# EAGLE design StackBreakoutConnection_4layers_V1.0 (EAGLE 9.4.2)
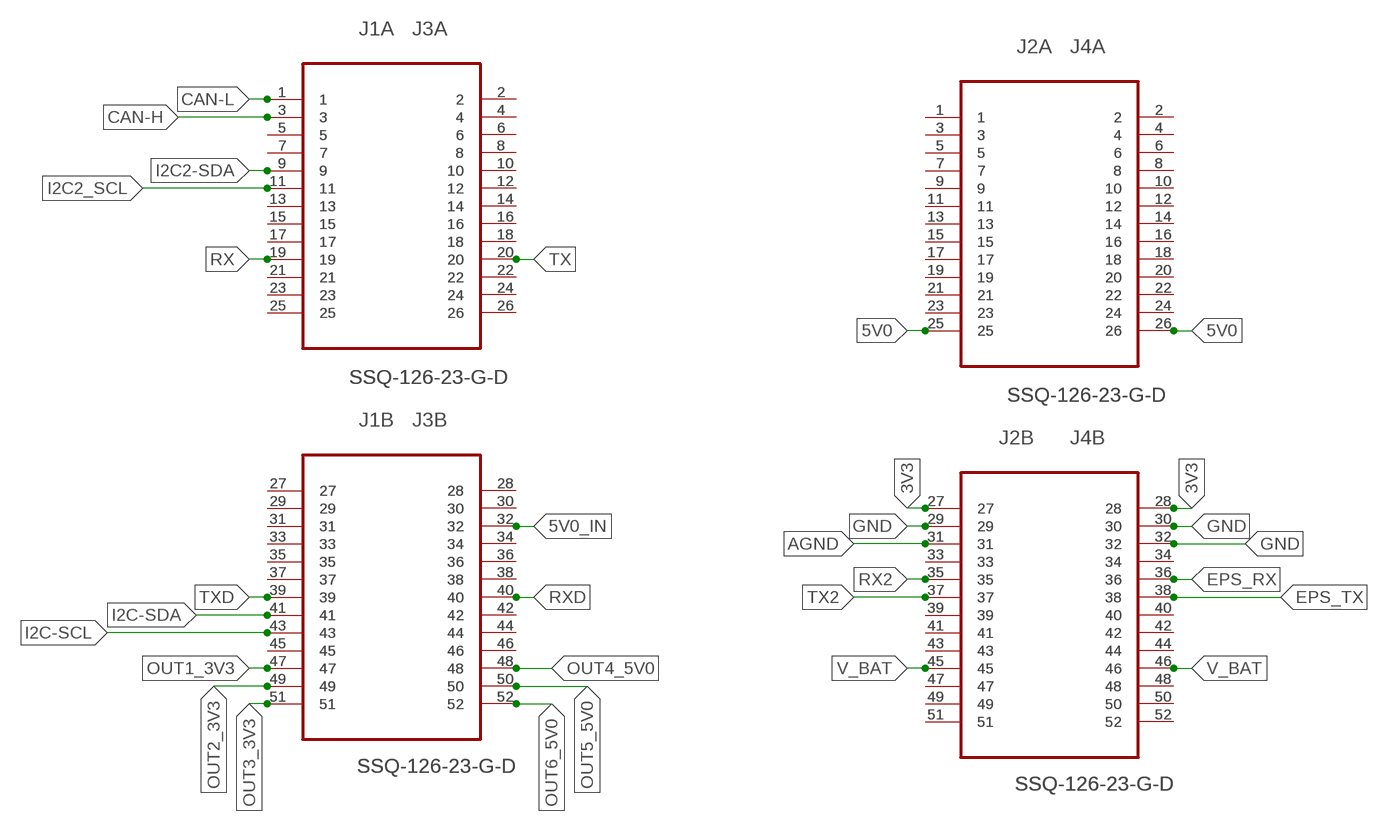
[diagram p0: schematic, sheet 1]

## Parts
J1  SSQ-126-23-G-D  [SAMTEC_SSQ-126-23-G-D]
J2  SSQ-126-23-G-D  [SAMTEC_SSQ-126-23-G-D]
J3  SSQ-126-23-G-D  [SAMTEC_SSQ-126-23-G-D]
J4  SSQ-126-23-G-D  [SAMTEC_SSQ-126-23-G-D]

## Nets
3V3: J2.27 J2.28 J4.27 J4.28
5V0: J2.25 J2.26 J4.25 J4.26
5V0_IN: J1.32 J3.32
AGND: J2.31 J4.31
CAN-H: J1.3 J3.3
CAN-L: J1.1 J3.1
EPS_RX: J2.36 J4.36
EPS_TX: J2.38 J4.38
GND: J2.29 J2.30 J2.32 J4.29 J4.30 J4.32
I2C2-SDA: J1.9 J3.9
I2C2_SCL: J1.11 J3.11
I2C-SCL: J1.43 J3.43
I2C-SDA: J1.41 J3.41
N$3: J1.5 J3.5
N$4: J1.7 J3.7
N$7: J1.13 J3.13
N$8: J1.15 J3.15
N$9: J1.17 J3.17
N$11: J1.21 J3.21
N$12: J1.23 J3.23
N$13: J1.25 J3.25
N$14: J1.2 J3.2
N$15: J1.4 J3.4
N$16: J1.6 J3.6
N$17: J1.8 J3.8
N$18: J1.10 J3.10
N$19: J1.12 J3.12
N$20: J1.14 J3.14
N$21: J1.16 J3.16
N$22: J1.18 J3.18
N$24: J1.22 J3.22
N$25: J1.24 J3.24
N$26: J1.26 J3.26
N$27: J1.27 J3.27
N$28: J1.29 J3.29
N$29: J1.31 J3.31
N$30: J1.33 J3.33
N$31: J1.35 J3.35
N$32: J1.37 J3.37
N$36: J1.45 J3.45
N$40: J1.28 J3.28
N$41: J1.30 J3.30
N$43: J1.34 J3.34
N$44: J1.36 J3.36
N$45: J1.38 J3.38
N$47: J1.42 J3.42
N$48: J1.44 J3.44
N$49: J1.46 J3.46
N$53: J2.1 J4.1
N$54: J2.3 J4.3
N$55: J2.5 J4.5
N$56: J2.7 J4.7
N$57: J2.9 J4.9
N$58: J2.11 J4.11
N$59: J2.13 J4.13
N$60: J2.15 J4.15
N$61: J2.17 J4.17
N$62: J2.19 J4.19
N$63: J2.21 J4.21
N$64: J2.23 J4.23
N$66: J2.2 J4.2
N$67: J2.4 J4.4
N$68: J2.6 J4.6
N$69: J2.8 J4.8
N$70: J2.10 J4.10
N$71: J2.12 J4.12
N$72: J2.14 J4.14
N$73: J2.16 J4.16
N$74: J2.18 J4.18
N$75: J2.20 J4.20
N$76: J2.22 J4.22
N$77: J2.24 J4.24
N$82: J2.33 J4.33
N$85: J2.39 J4.39
N$86: J2.41 J4.41
N$87: J2.43 J4.43
N$89: J2.47 J4.47
N$90: J2.49 J4.49
N$91: J2.51 J4.51
N$95: J2.34 J4.34
N$98: J2.40 J4.40
N$99: J2.42 J4.42
N$100: J2.44 J4.44
N$102: J2.48 J4.48
N$103: J2.50 J4.50
N$104: J2.52 J4.52
OUT1_3V3: J1.47 J3.47
OUT2_3V3: J1.49 J3.49
OUT3_3V3: J1.51 J3.51
OUT4_5V0: J1.48 J3.48
OUT5_5V0: J1.50 J3.50
OUT6_5V0: J1.52 J3.52
RX: J1.19 J3.19
RX2: J2.35 J4.35
RXD: J1.40 J3.40
TX: J1.20 J3.20
TX2: J2.37 J4.37
TXD: J1.39 J3.39
V_BAT: J2.45 J2.46 J4.45 J4.46

## Library data of the parts
J1-J4 = SPEL:SSQ-126-23-G-D: CONN RECEPTACLE, 2.54MM, DUAL, 52WAY; MPN: SSQ-126-23-G-D; OC_FARNELL: -; OC_NEWARK: 82P0504; PACKAGE: RECEPTACLE, 2.54MM, DUAL, 52WAY; SUPPLIER: Samtec

## Board
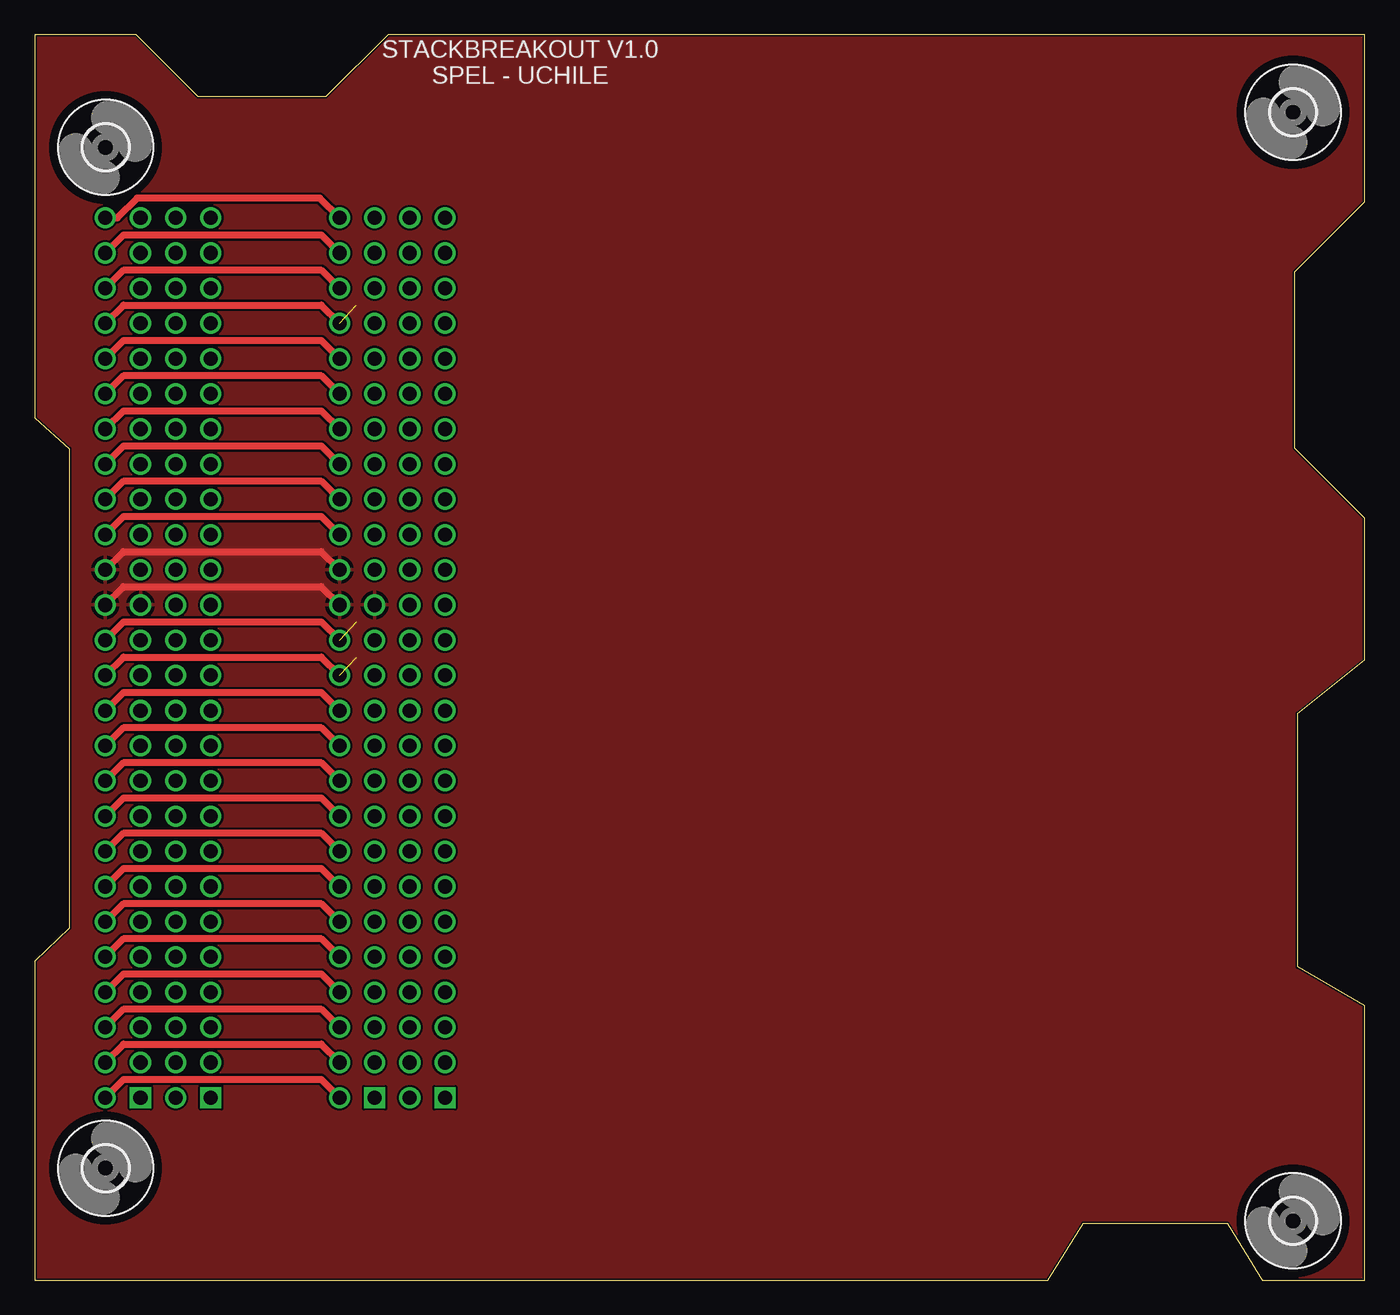
[diagram p1: board, top side]
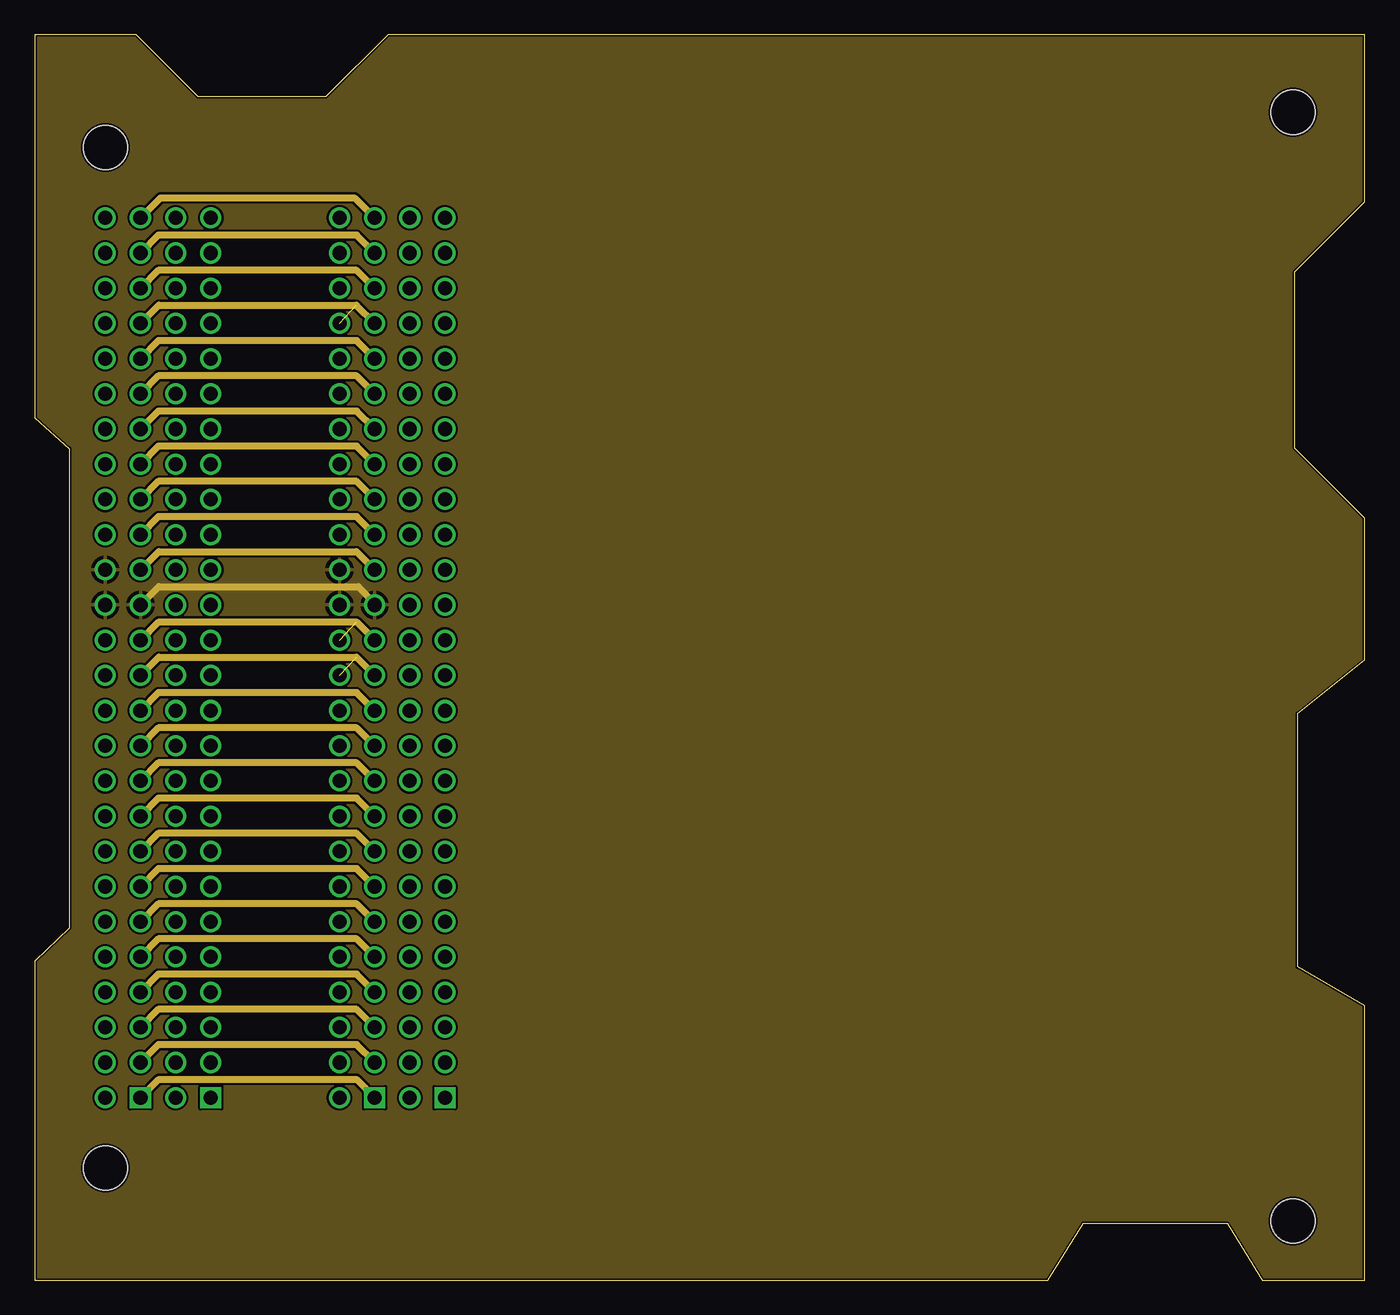
[diagram p2: board, inner layer Route2]
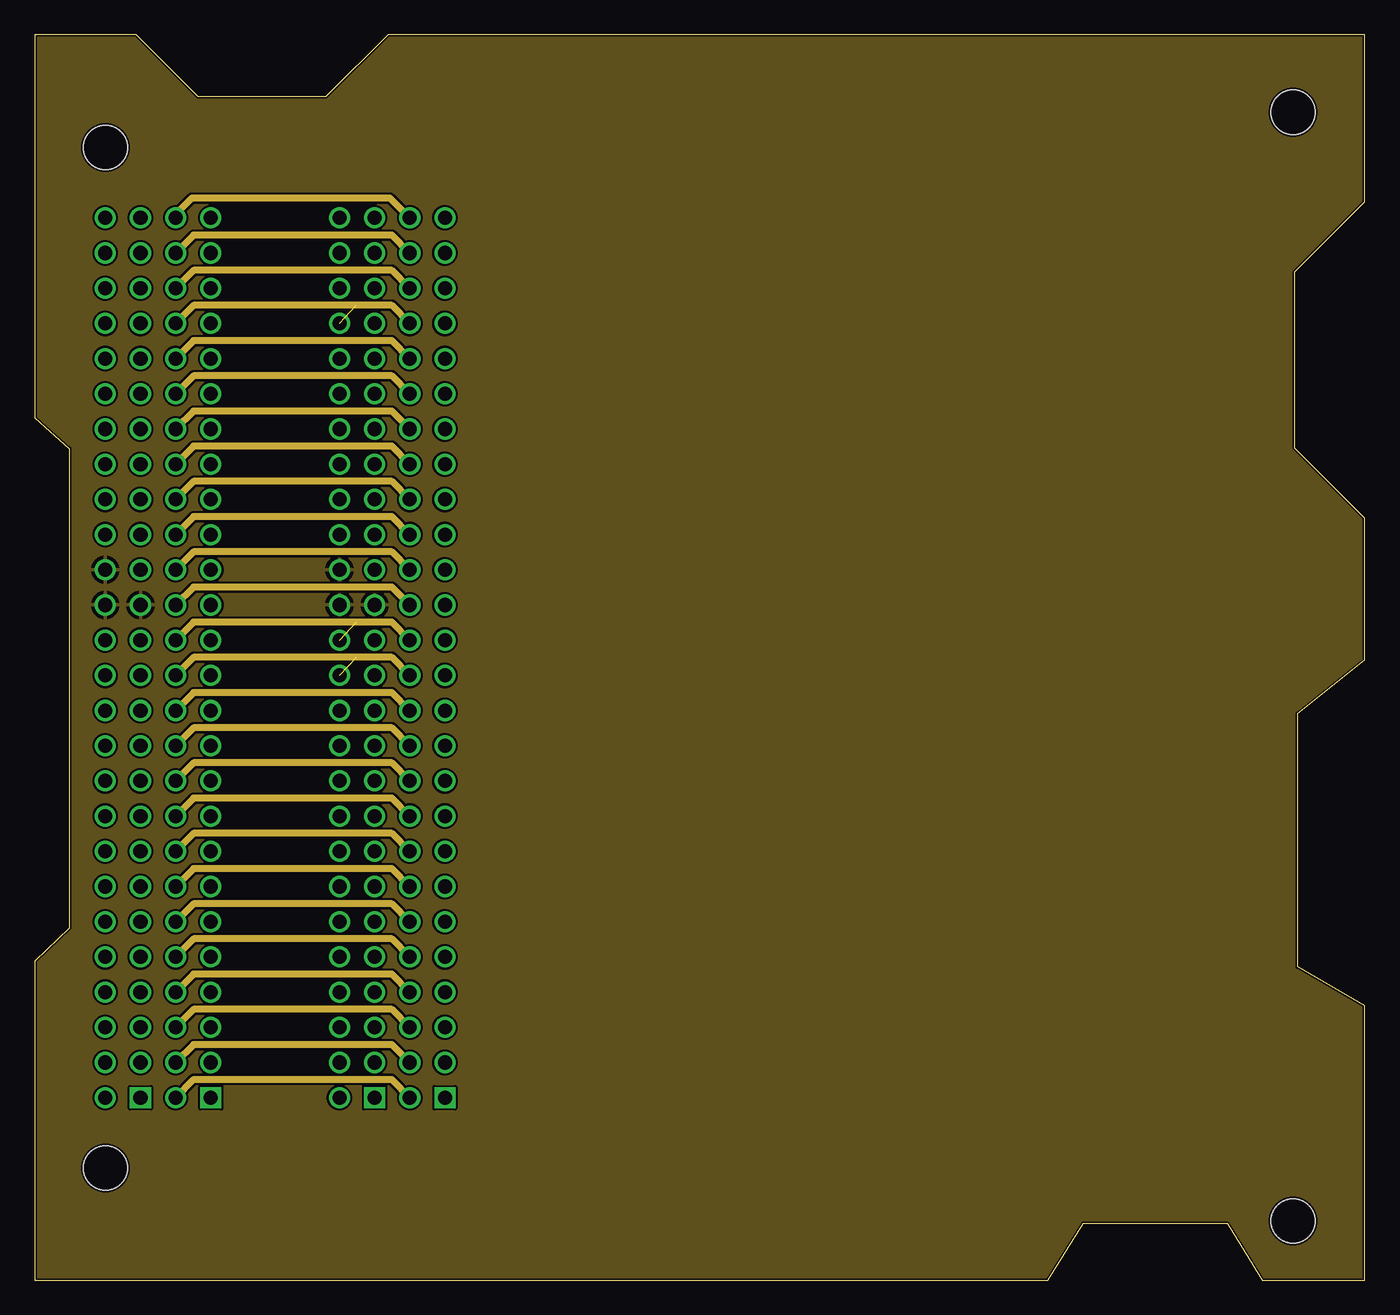
[diagram p3: board, inner layer Route15]
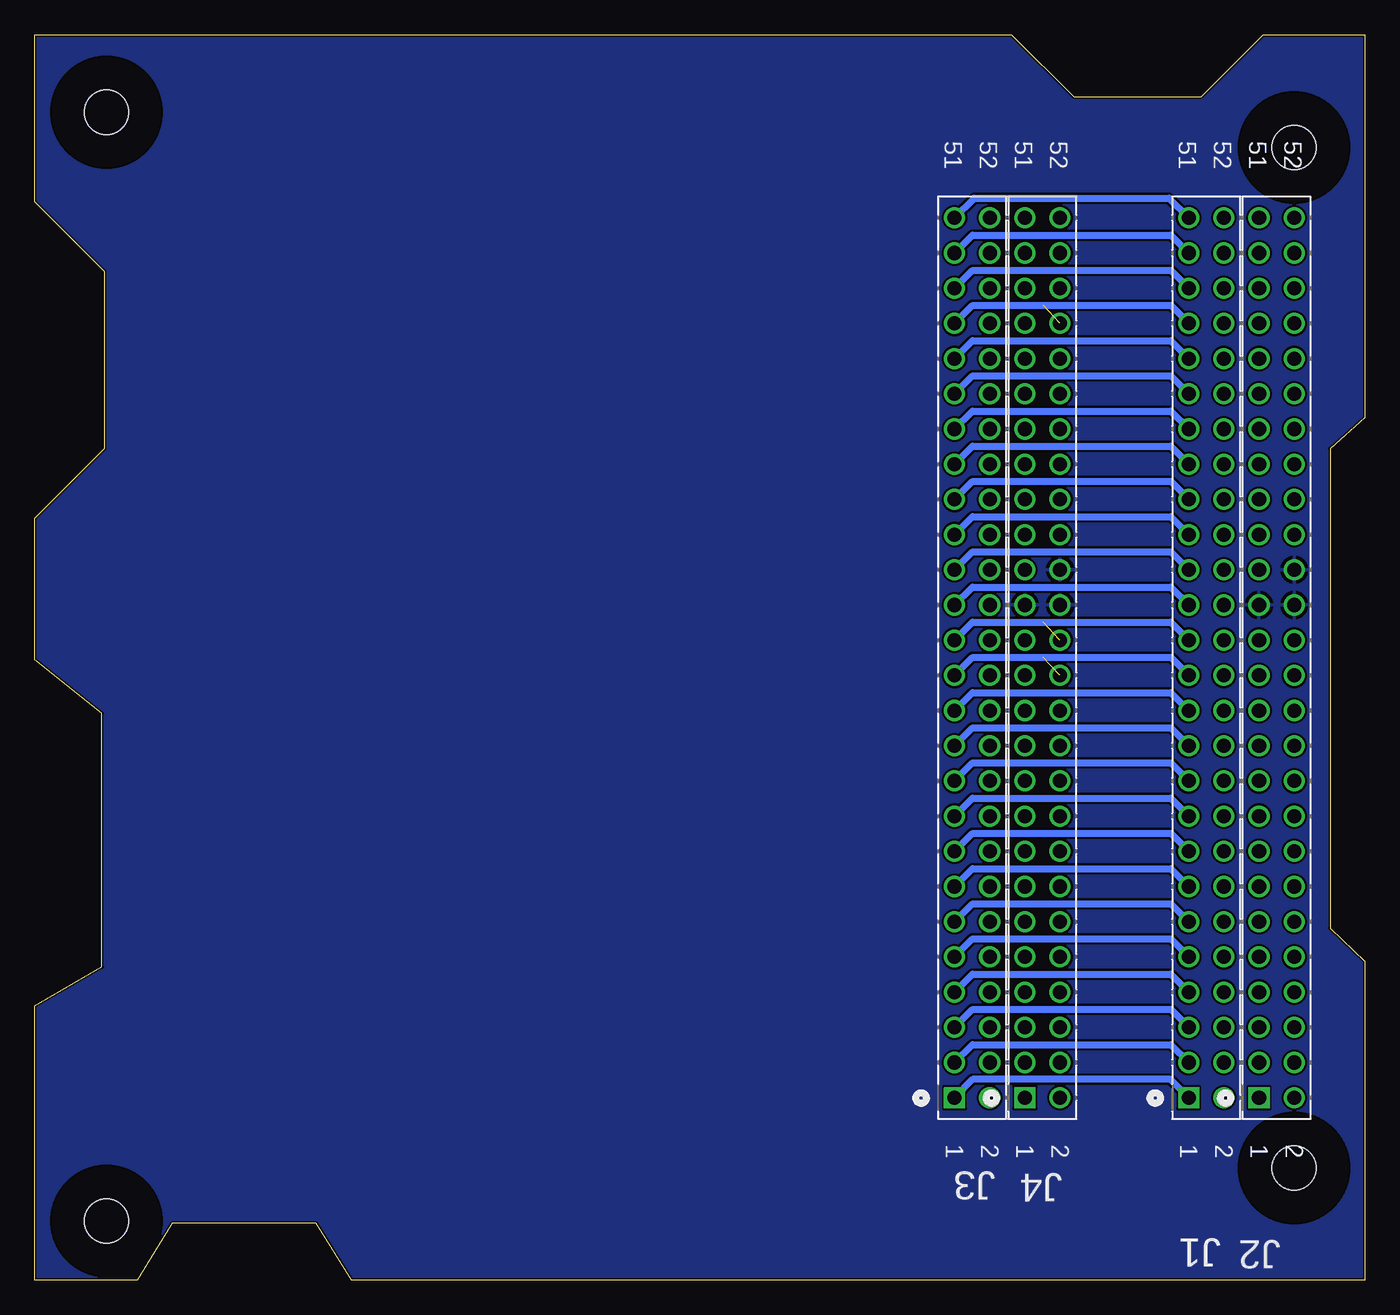
[diagram p4: board, bottom side, seen from below]

Size 96.04 x 89.88 mm. Coordinates in mm from the lower left corner, seen from the top.
Outline: 90.98,72.77 96.04,77.83 96.04,89.88 25.51,89.88 21.02,85.4 11.8,85.4 7.32,89.88 0,89.88 0,62.23 2.5,60 2.5,25.4 0,23 0,0 73.15,0 75.7,4.1 86.09,4.1 88.65,0 96.01,0 96.01,19.81 91.19,22.61 91.19,40.89 96.04,44.76 96.04,54.97 90.98,60.02 90.98,72.77
Copper layers (1+2*15+16): Top 0.035mm / dielectric 1.5mm / Route2 0.035mm / dielectric 0.15mm / Route15 0.035mm / dielectric 0.2mm / Bottom 0.035mm
Design rules "default *": minimum track width 6mil, minimum drill 0.2mm, track to track 6mil, track to pad 6mil, pad to pad 6mil, via to via 6mil, smd to smd 6mil, copper to edge 6mil, drill to drill 6mil, minimum pad ring 10mil, minimum via ring 8mil, stop-mask expansion 4mil, vias tented up to drill 0mil, thermal gap 10mil

### Footprints (pad centres in the part's own frame; a part is rotated, then mirrored left to right if it is on the bottom)
SAMTEC_SSQ-126-23-G-D = drill 1.016 square: 1 63.5,-2.54 | drill 1.016: 2 63.5,0; 3 60.96,-2.54; 4 60.96,0; 5 58.42,-2.54; 6 58.42,0; 7 55.88,-2.54; 8 55.88,0; 9 53.34,-2.54; 10 53.34,0; 11 50.8,-2.54; 12 50.8,0; 13 48.26,-2.54; 14 48.26,0; 15 45.72,-2.54; 16 45.72,0; 17 43.18,-2.54; 18 43.18,0; 19 40.64,-2.54; 20 40.64,0; 21 38.1,-2.54; 22 38.1,0; 23 35.56,-2.54; 24 35.56,0; 25 33.02,-2.54; 26 33.02,0; 27 30.48,-2.54; 28 30.48,0; 29 27.94,-2.54; 30 27.94,0; 31 25.4,-2.54; 32 25.4,0; 33 22.86,-2.54; 34 22.86,0; 35 20.32,-2.54; 36 20.32,0; 37 17.78,-2.54; 38 17.78,0; 39 15.24,-2.54; 40 15.24,0; 41 12.7,-2.54; 42 12.7,0; 43 10.16,-2.54; 44 10.16,0; 45 7.62,-2.54; 46 7.62,0; 47 5.08,-2.54; 48 5.08,0; 49 2.54,-2.54; 50 2.54,0; 51 0,-2.54; 52 0,0
3,2 = hole 3.2: 0,0

### Placement (x,y rotation side)
J1  10.18,76.66 270 bottom
J2  5.1,76.66 270 bottom
J3  27.09,76.66 270 bottom
J4  22.01,76.66 270 bottom
U$1  [3,2]  5.12,81.74 0 top
U$2  [3,2]  90.85,84.28 0 top
U$3  [3,2]  90.85,4.27 0 top
U$4  [3,2]  5.12,8.08 0 top

### Tracks (layer width: path | path; a pad name or v marks a point on that pad's centre or on a via)
3V3  (1 unrouted)
  Top 0.508: J2.28 6.42,47.5 20.7,47.5 22.01,46.19 J4.28
  Route2 0.508: J2.27 8.96,47.5 23.24,47.5 24.55,46.19 J4.27
5V0  (1 unrouted)
  Top 0.508: J2.26 6.42,44.96 20.7,44.96 22.01,43.65 J4.26
  Route2 0.508: J2.25 8.96,44.96 23.24,44.96 24.55,43.65 J4.25
5V0_IN
  Route15 0.508: J3.32 25.79,52.55 11.47,52.55 J1.32
AGND
  Route2 0.508: J2.31 8.96,52.58 23.24,52.58 24.55,51.27 J4.31
CAN-H
  Bottom 0.508: J3.3 28.33,17 14.02,17 J1.3
CAN-L
  Bottom 0.508: J1.1 14.04,14.48 28.32,14.48 29.63,13.17 J3.1
EPS_RX
  Top 0.508: J4.36 20.71,57.63 6.39,57.63 J2.36
EPS_TX
  Top 0.508: J4.38 20.71,60.17 6.39,60.17 J2.38
GND
  Top 0.508: J2.30 6.42,50.04 20.7,50.04 22.01,48.73 J4.30 | J2.32 6.42,52.58 20.7,52.58 22.01,51.27 J4.32
  Route2 0.508: J2.29 8.96,50.04 23.37,50.04 24.55,48.86 J4.29
  pour Route15: -0.22,90.12 7.77,90.12 7.77,90.04 12.04,85.77 20.96,85.77 26.02,90.83 96.4,90.83 96.71,90.52 96.71,77.77 91.45,72.52 91.45,60.39 96.5,55.34 96.5,44.84 91.56,39.9 91.56,22.84 96.45,20.03 96.45,-0.36 88.28,-0.36 85.72,3.61 76.26,3.61 73.9,-0.36 -0.35,-0.36 -0.35,23.1 2.23,25.67 2.23,59.72 -0.23,62.18 -0.23,90.12 -0.23,90.12
  pour Top: -0.25,-0.13 73.41,-0.13 76.03,3.81 85.89,3.81 88.6,-0.25 96.27,-0.25 96.27,20.57 91.44,22.99 91.44,40.58 96.27,44.2 96.27,55.24 91.31,60.2 91.31,72.64 96.39,77.72 96.39,90.17 24.89,90.17 20.57,85.85 11.65,85.85 8.22,90.42 -0.25,90.42 -0.25,62.23 2.29,59.69 2.29,25.65 -0.25,23.11
  pour Route2: -0.46,-0.28 73.46,-0.28 76.08,3.66 85.9,3.66 88.53,-0.28 96.32,-0.28 96.32,20.42 91.87,22.64 91.87,40.87 96.32,44.2 96.32,55.22 91.36,60.17 91.36,72.62 96.44,77.7 96.44,90.4 25.32,90.4 20.75,85.83 11.77,85.83 8.62,90.02 -0.2,90.02 -0.2,62.33 2.08,60.05 2.08,25.88 -0.46,23.34
  pour Bottom: -0.27,90.34 7.08,90.34 7.08,90.4 11.74,85.74 11.74,85.86 20.77,85.86 26.09,91.18 95.59,91.18 96.65,90.11 96.65,77.24 91.53,72.11 91.53,60.11 96.71,54.93 96.71,44.56 91.64,39.49 91.64,22.93 96.27,20.25 96.27,-0.51 88.48,-0.51 85.92,3.45 76.54,3.45 74.18,-0.51 -0.4,-0.51 -0.4,23.33 2.18,25.9 2.18,59.57 -0.28,62.03 -0.28,90.35 -0.28,90.35
I2C2-SDA
  Bottom 0.508: J3.9 28.33,24.61 14.02,24.61 J1.9
I2C2_SCL
  Bottom 0.508: J3.11 28.33,27.16 14.02,27.16 J1.11
I2C-SCL
  Bottom 0.508: J3.43 28.33,67.8 14.02,67.8 J1.43
I2C-SDA
  Bottom 0.508: J3.41 28.33,65.25 14.02,65.25 J1.41
N$3
  Bottom 0.508: J3.5 28.33,19.54 14.02,19.54 J1.5
N$4
  Bottom 0.508: J3.7 28.33,22.07 14.02,22.07 J1.7
N$7
  Bottom 0.508: J3.13 28.33,29.7 14.02,29.7 J1.13
N$8
  Bottom 0.508: J3.15 28.33,32.23 14.02,32.23 J1.15
N$9
  Bottom 0.508: J3.17 28.33,34.77 14.02,34.77 J1.17
N$11
  Bottom 0.508: J3.21 28.33,39.85 14.02,39.85 J1.21
N$12
  Bottom 0.508: J3.23 28.33,42.4 14.02,42.4 J1.23
N$13
  Bottom 0.508: J3.25 28.33,44.94 14.02,44.94 J1.25
N$14
  Route15 0.508: J1.2 11.5,14.48 25.78,14.48 27.09,13.17 J3.2
N$15
  Route15 0.508: J3.4 25.79,17 11.47,17 J1.4
N$16
  Route15 0.508: J3.6 25.79,19.54 11.47,19.54 J1.6
N$17
  Route15 0.508: J3.8 25.79,22.07 11.47,22.07 J1.8
N$18
  Route15 0.508: J3.10 25.79,24.61 11.47,24.61 J1.10
N$19
  Route15 0.508: J3.12 25.79,27.16 11.47,27.16 J1.12
N$20
  Route15 0.508: J3.14 25.79,29.7 11.47,29.7 J1.14
N$21
  Route15 0.508: J3.16 25.79,32.23 11.47,32.23 J1.16
N$22
  Route15 0.508: J3.18 25.79,34.77 11.47,34.77 J1.18
N$24
  Route15 0.508: J3.22 25.79,39.85 11.47,39.85 J1.22
N$25
  Route15 0.508: J3.24 25.79,42.4 11.47,42.4 J1.24
N$26
  Route15 0.508: J3.26 25.79,44.94 11.47,44.94 J1.26
N$27
  Bottom 0.508: J3.27 28.33,47.48 14.02,47.48 J1.27
N$28
  Bottom 0.508: J3.29 28.33,50.02 14.02,50.02 J1.29
N$29
  Bottom 0.508: J3.31 28.33,52.55 14.02,52.55 J1.31
N$30
  Bottom 0.508: J3.33 28.33,55.09 14.02,55.09 J1.33
N$31
  Bottom 0.508: J3.35 28.33,57.63 14.02,57.63 J1.35
N$32
  Bottom 0.508: J3.37 28.33,60.17 14.02,60.17 J1.37
N$36
  Bottom 0.508: J3.45 28.33,70.33 14.02,70.33 J1.45
N$40
  Route15 0.508: J3.28 25.79,47.48 11.47,47.48 J1.28
N$41
  Route15 0.508: J3.30 25.79,50.02 11.47,50.02 J1.30
N$43
  Route15 0.508: J3.34 25.79,55.09 11.47,55.09 J1.34
N$44
  Route15 0.508: J3.36 25.79,57.63 11.47,57.63 J1.36
N$45
  Route15 0.508: J3.38 25.79,60.17 11.47,60.17 J1.38
N$47
  Route15 0.508: J3.42 25.79,65.25 11.47,65.25 J1.42
N$48
  Route15 0.508: J3.44 25.79,67.8 11.47,67.8 J1.44
N$49
  Route15 0.508: J3.46 25.79,70.33 11.47,70.33 J1.46
N$53
  Route2 0.508: J2.1 8.96,14.48 23.24,14.48 24.55,13.17 J4.1
N$54
  Route2 0.508: J4.3 23.25,17 8.94,17 J2.3
N$55
  Route2 0.508: J4.5 23.25,19.54 8.94,19.54 J2.5
N$56
  Route2 0.508: J4.7 23.25,22.07 8.94,22.07 J2.7
N$57
  Route2 0.508: J4.9 23.25,24.61 8.94,24.61 J2.9
N$58
  Route2 0.508: J4.11 23.25,27.16 8.94,27.16 J2.11
N$59
  Route2 0.508: J4.13 23.25,29.7 8.94,29.7 J2.13
N$60
  Route2 0.508: J4.15 23.25,32.23 8.94,32.23 J2.15
N$61
  Route2 0.508: J4.17 23.25,34.77 8.94,34.77 J2.17
N$62
  Route2 0.508: J4.19 23.25,37.31 8.94,37.31 J2.19
N$63
  Route2 0.508: J4.21 23.25,39.85 8.94,39.85 J2.21
N$64
  Route2 0.508: J4.23 23.25,42.4 8.94,42.4 J2.23
N$66
  Top 0.508: J2.2 6.42,14.48 20.7,14.48 22.01,13.17 J4.2
N$67
  Top 0.508: J2.4 6.42,17.02 20.69,17.02 J4.4
N$68
  Top 0.508: J4.6 20.71,19.54 6.39,19.54 J2.6
N$69
  Top 0.508: J4.8 20.71,22.07 6.39,22.07 J2.8
N$70
  Top 0.508: J4.10 20.71,24.61 6.39,24.61 J2.10
N$71
  Top 0.508: J4.12 20.71,27.16 6.39,27.16 J2.12
N$72
  Top 0.508: J4.14 20.71,29.7 6.39,29.7 J2.14
N$73
  Top 0.508: J4.16 20.71,32.23 6.39,32.23 J2.16
N$74
  Top 0.508: J4.18 20.71,34.77 6.39,34.77 J2.18
N$75
  Top 0.508: J4.20 20.71,37.31 6.39,37.31 J2.20
N$76
  Top 0.508: J4.22 20.71,39.85 6.39,39.85 J2.22
N$77
  Top 0.508: J4.24 20.71,42.4 6.39,42.4 J2.24
N$82
  Route2 0.508: J4.33 23.25,55.09 8.94,55.09 J2.33
N$85
  Route2 0.508: J4.39 23.25,62.72 8.94,62.72 J2.39
N$86
  Route2 0.508: J4.41 23.25,65.25 8.94,65.25 J2.41
N$87
  Route2 0.508: J4.43 23.25,67.8 8.94,67.8 J2.43
N$89
  Route2 0.508: J4.47 23.25,72.88 8.94,72.88 J2.47
N$90
  Route2 0.508: J4.49 23.25,75.42 8.94,75.42 J2.49
N$91
  Route2 0.508: J2.51 9.09,78.11 23.1,78.11 J4.51
N$95
  Top 0.508: J4.34 20.71,55.09 6.39,55.09 J2.34
N$98
  Top 0.508: J4.40 20.71,62.72 6.39,62.72 J2.40
N$99
  Top 0.508: J4.42 20.71,65.25 6.39,65.25 J2.42
N$100
  Top 0.508: J4.44 20.71,67.8 6.39,67.8 J2.44
N$102
  Top 0.508: J4.48 20.71,72.88 6.39,72.88 J2.48
N$103
  Top 0.508: J4.50 20.71,75.42 6.39,75.42 J2.50
N$104
  Top 0.508: J4.52 20.58,78.08 7.39,78.08 5.97,76.66 J2.52
OUT1_3V3
  Bottom 0.508: J3.47 28.33,72.88 14.02,72.88 J1.47
OUT2_3V3
  Bottom 0.508: J3.49 28.33,75.42 14.02,75.42 J1.49
OUT3_3V3
  Bottom 0.508: J3.51 28.2,78.08 14.14,78.08 J1.51
OUT4_5V0
  Route15 0.508: J3.48 25.79,72.88 11.47,72.88 J1.48
OUT5_5V0
  Route15 0.508: J3.50 25.79,75.42 11.47,75.42 J1.50
OUT6_5V0
  Route15 0.508: J3.52 25.66,78.08 11.35,78.08 10.18,76.91 J1.52
RX
  Bottom 0.508: J3.19 28.33,37.31 14.02,37.31 J1.19
RX2
  Route2 0.508: J4.35 23.25,57.63 8.94,57.63 J2.35
RXD
  Route15 0.508: J3.40 25.79,62.72 11.47,62.72 J1.40
TX
  Route15 0.508: J3.20 25.79,37.31 11.47,37.31 J1.20
TX2
  Route2 0.508: J4.37 23.25,60.17 8.94,60.17 J2.37
TXD
  Bottom 0.508: J3.39 28.33,62.72 14.02,62.72 J1.39
V_BAT  (1 unrouted)
  Top 0.508: J2.46 6.42,70.36 20.69,70.36 J4.46
  Route2 0.508: J2.45 8.96,70.36 23.23,70.36 J4.45

### Text on the board
tPlace: STACKBREAKOUT V1.0 / SPEL - UCHILE